# EAGLE schematic FeatherBoardTemplate (EAGLE 8.3.2)
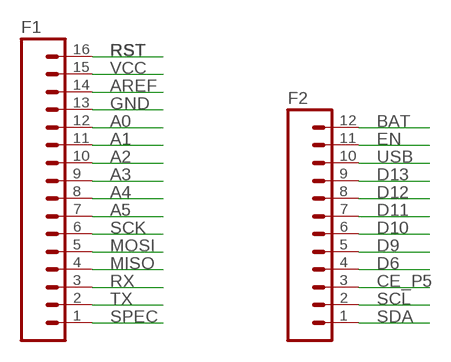
[diagram p0: schematic, sheet 1]

## Parts
F1  M16PTH  [1X16]
F2  M12PTH  [1X12]

## Nets
A0: F1.12
A1: F1.11
A2: F1.10
A3: F1.9
A4: F1.8
A5: F1.7
AREF: F1.14
BAT: F2.12
CE_P5: F2.3
D6: F2.4
D9: F2.5
D10: F2.6
D11: F2.7
D12: F2.8
D13: F2.9
EN: F2.11
GND: F1.13
MISO: F1.4
MOSI: F1.5
RST: F1.16
RX: F1.3
SCK: F1.6
SCL: F2.2
SDA: F2.1
SPEC: F1.1
TX: F1.2
USB: F2.10
VCC: F1.15

## Library data of the parts
F1 = SparkFun-Connectors:M16: 1x16 .1" header
F2 = SparkFun-Connectors:M12: Header 12 Standard 12-pin 0.1" header. Use with straight break away headers (SKU : PRT-00116), right angle break away headers (PRT-00553), swiss pins (PRT-00743), machine pins (PRT-00117), and female headers (PRT-00115).